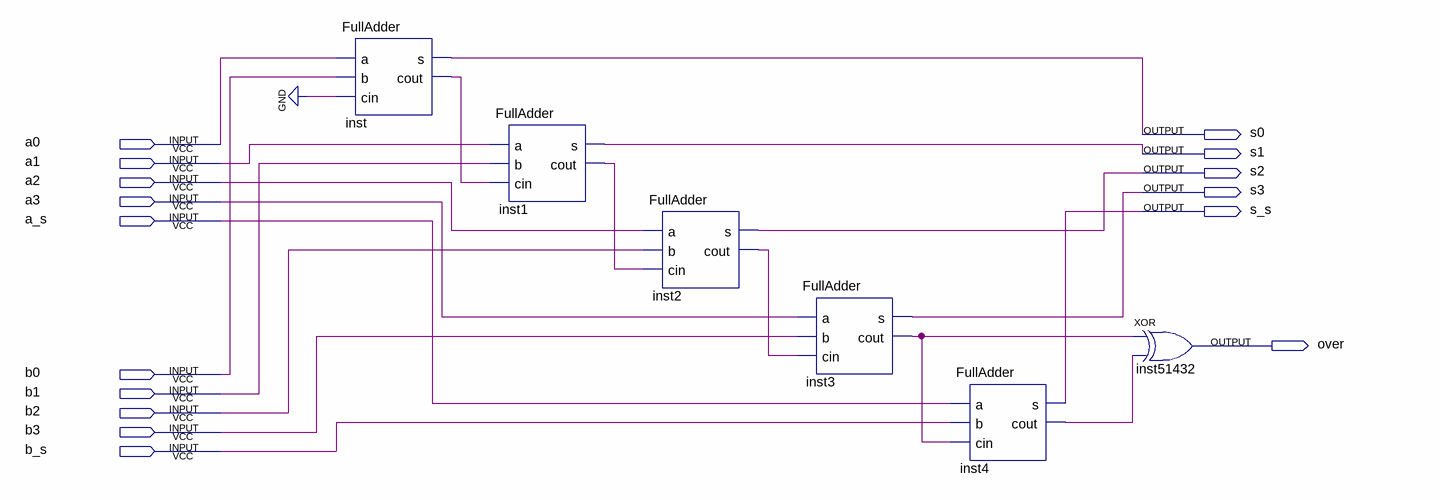
[diagram p0: schematic sheet]
// Quartus schematic Comp2Adder.bdf as structural Verilog: 6 symbols, 16 pins
module Comp2Adder (
  input  a0,
  input  a1,
  input  a2,
  input  a3,
  input  a_s,
  input  b0,
  input  b1,
  input  b2,
  input  b3,
  input  b_s,
  output s0,
  output s1,
  output s2,
  output s3,
  output s_s,
  output over
);

  wire inst1_cout, inst2_cout, inst3_cout, inst4_cout, inst_cout;

  FullAdder inst (.a(a0), .b(b0), .cin(1'b0), .s(s0), .cout(inst_cout));
  FullAdder inst1 (.a(a1), .b(b1), .cin(inst_cout), .s(s1), .cout(inst1_cout));
  FullAdder inst2 (.a(a2), .b(b2), .cin(inst1_cout), .s(s2), .cout(inst2_cout));
  FullAdder inst3 (.a(a3), .b(b3), .cin(inst2_cout), .s(s3), .cout(inst3_cout));
  FullAdder inst4 (.a(a_s), .b(b_s), .cin(inst3_cout), .s(s_s), .cout(inst4_cout));
  xor inst51432 (over, inst3_cout, inst4_cout);
endmodule
